# Altium project OnePhase.PrjPcb
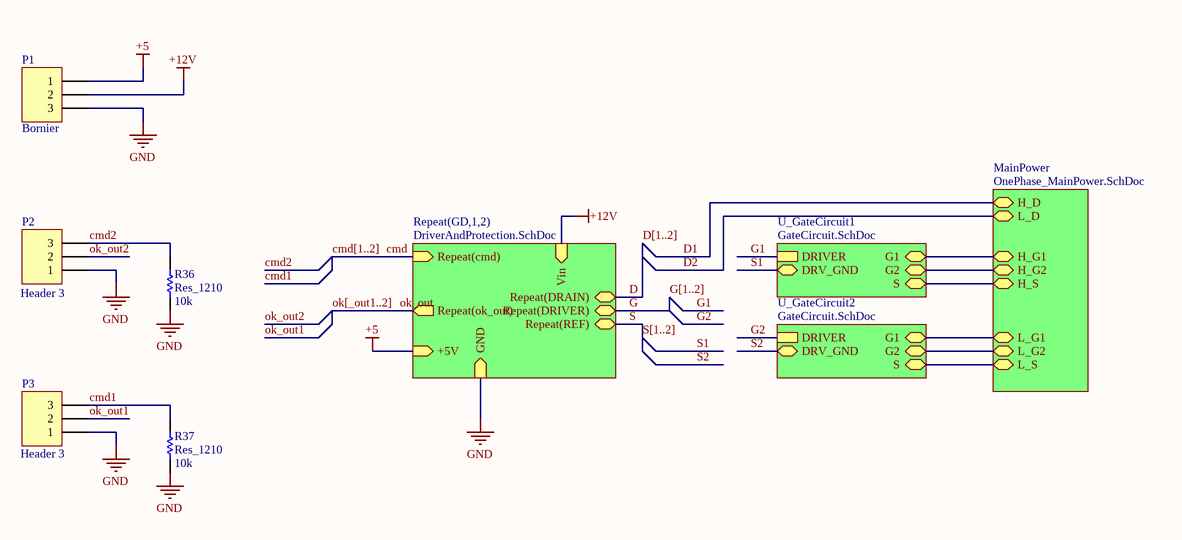
[diagram p0: OnePhaseMain.SchDoc]
5 sheets, 211 parts. Net scope: strictly hierarchical (ports join the sheet entries above them; power ports are local).
Board files: OnePhaseSemLogica_V4.PcbDoc, OnePhaseSemLogica_V3.PcbDoc, OnePhaseSemLogica_V1.PcbDoc
Sheets:
  OnePhaseMain.SchDoc
    GD1 = DriverAndProtection.SchDoc
      Supply_Iso = GateDriverPowerSupply.SchDoc
    GD2 = DriverAndProtection.SchDoc
      Supply_Iso = GateDriverPowerSupply.SchDoc
    MainPower = OnePhase_MainPower.SchDoc
    U_GateCircuit1 = GateCircuit.SchDoc
    U_GateCircuit2 = GateCircuit.SchDoc

## Sheet OnePhaseMain.SchDoc: Test of one arm
size A4; CheckedBy: Hildo Guillardi Júnior; Author: Fellipe; Organization: UNICAMP / LCEE; Address1: University of Campinas - Brazil; Address2: Power Conditioning Laboratory; Address3: Licensed by GNU GPL 3.0; PageSetup: Record=PageOptions|CenterHorizontal=True|CenterVertical=True|PrintScale=0.97|XCorrection=1.00|YCorrection=1.00|PrintKind=1|BorderSize=5000000|LeftOffset=0|BottomOffset=0|Orientation=2|PaperLength=1000|PaperWidth=1000|Scale=100|PaperSource=257|PrintQuality=600|MediaType=1|DitherType=10|PrintScaleMode=1|PaperKind=A4|PaperIndex=9; ProjectName: Easy Inverter

### Parts
P1  Bornier  [3 Pin  Borner]
P2  Header 3  [HDR1X3]
P3  Header 3  [HDR1X3]
R36  Res_1210  value 10k  [0805_W]
R37  Res_1210  value 10k  [0805_W]

### Sub-sheets
MainPower = OnePhase_MainPower.SchDoc: H_D, L_D, L_S, H_S, L_G1, H_G1, H_G2, L_G2
Repeat(GD,1,2) = DriverAndProtection.SchDoc: Repeat(cmd) (in), Repeat(DRAIN), Repeat(DRIVER), Repeat(REF), GND (in), Vin (in), +5V (in), Repeat(ok_out) (out)
U_GateCircuit1 = GateCircuit.SchDoc: DRIVER, S, G1, DRV_GND, G2
U_GateCircuit2 = GateCircuit.SchDoc: DRIVER, S, G1, DRV_GND, G2

### Nets
+5: P1.1 ; sheet Repeat(GD,1,2)/+5V
+12V: P1.2 ; sheet Repeat(GD,1,2)/Vin
GND: P1.3 P2.1 P3.1 R36.2 R37.2 ; sheet Repeat(GD,1,2)/GND
cmd: sheet Repeat(GD,1,2)/Repeat(cmd)
cmd1: P3.3 R37.1
cmd2: P2.3 R36.1
D: sheet Repeat(GD,1,2)/Repeat(DRAIN)
D2: sheet MainPower/L_D, sheet MainPower/H_S, sheet U_GateCircuit1/S
G: sheet Repeat(GD,1,2)/Repeat(DRIVER)
ok_out: sheet Repeat(GD,1,2)/Repeat(ok_out)
ok_out1: P3.2
ok_out2: P2.2
S: sheet Repeat(GD,1,2)/Repeat(REF)
NetC28_2: sheet MainPower/L_S, sheet U_GateCircuit2/S
NetQ5_1: sheet MainPower/H_G1, sheet U_GateCircuit1/G1
NetQ6_1: sheet MainPower/H_G2, sheet U_GateCircuit1/G2
NetQ7_1: sheet MainPower/L_G1, sheet U_GateCircuit2/G1
NetQ8_1: sheet MainPower/L_G2, sheet U_GateCircuit2/G2

### Buses and harness runs
bus cmd[1..2]
bus D[1..2]
bus G[1..2]
bus ok[_out1..2]
bus S[1..2]

### Notes on the sheet
- Title
- Author
- Revisor
- Hildo G Jr
- Revision:
- Sheet
- of
- File:
- Size:
- A4
- HGJr

### Library data of the parts
P1 = Header 3: Header, 3-Pin; pn: 1935174; Value: Bornier
P2 P3 = Header 3: Header, 3-Pin; Value: Header 3
R36 R37 = Res_0805: Resistor; pn: RMCF0805JT10K0

## Sheet DriverAndProtection.SchDoc: Drive and protections
size A4; CheckedBy: Hildo Guillardi Júnior; Author: Fellipe; Organization: UNICAMP / LCEE; Address1: University of Campinas - Brazil; Address2: Power Conditioning Laboratory; Address3: Licensed by GNU GPL 3.0; ProjectName: Easy Inverter
Used 2 times, as channels GD1, GD2. Parts and nets are listed once, with the designators drawn on the sheet.
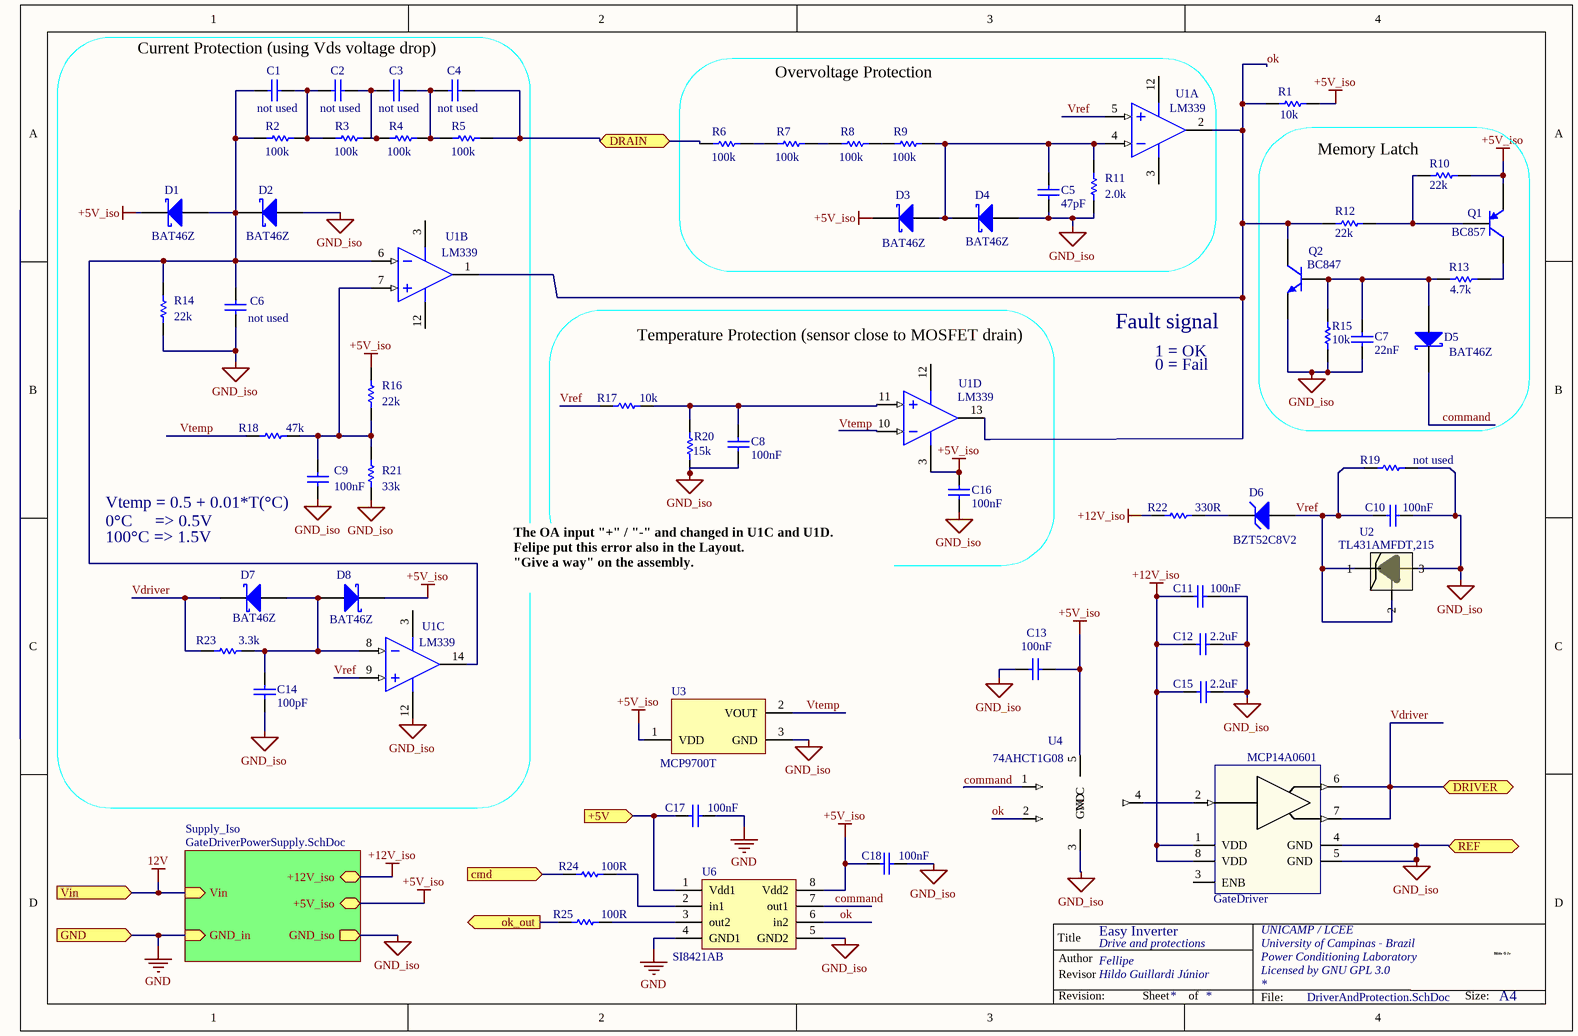
[diagram p1: DriverAndProtection.SchDoc]

### Parts
C1  value not used  [0805_W]
C2  value not used  [0805_W]
C3  value not used  [0805_W]
C4  value not used  [0805_W]
C5  value 47pF  [0805_W]
C6  value not used  [0805_W]
C7  value 22nF  [0805_W]
C8  value 100nF  [0805_W]
C9  value 100nF  [0805_W]
C10  value 100nF  [0805_W]
C11  value 100nF  [0805_W]
C12  value 2.2uF  [0805_W]
C13  value 100nF  [0805_W]
C14  value 100pF  [0805_W]
C15  value 2.2uF  [0805_W]
C16  value 100nF  [0805_W]
C17  value 100nF  [0805_W]
C18  value 100nF  [0805_W]
D1  value BAT46Z  [SOD-123]
D2  value BAT46Z  [SOD-123]
D3  value BAT46Z  [SOD-123]
D4  value BAT46Z  [SOD-123]
D5  value BAT46Z  [SOD-123]
D6  value BZT52C8V2  [SOD-123]
D7  value BAT46Z  [SOD-123]
D8  value BAT46Z  [SOD-123]
GateDriver  value MCP14A0601  [SOIC-8N]
Q1  value BC857  [SOT-23-TT3_N]
Q2  value BC847  [SOT-23-TT3_N]
R1  value 10k  [0805_W]
R2  value 100k  [0805_W]
R3  value 100k  [0805_W]
R4  value 100k  [0805_W]
R5  value 100k  [0805_W]
R6  value 100k  [0805_W]
R7  value 100k  [0805_W]
R8  value 100k  [0805_W]
R9  value 100k  [0805_W]
R10  value 22k  [0805_W]
R11  value 2.0k  [0805_W]
R12  value 22k  [0805_W]
R13  value 4.7k  [0805_W]
R14  value 22k  [0805_W]
R15  value 10k  [0805_W]
R16  value 22k  [0805_W]
R17  value 10k  [0805_W]
R18  value 47k  [0805_W]
R19  value not used  [0805_W]
R20  value 15k  [0805_W]
R21  value 33k  [0805_W]
R22  value 330R  [0805_W]
R23  value 3.3k  [0805_W]
R24  value 100R  [0805_W]
R25  value 100R  [0805_W]
U1  value LM339  [SOIC-14N]  (parts A,B,C,D of 4)
U2  value TL431AMFDT,215  [SOT-23-TT3_M]
U3  value MCP9700T  [SOT-23_L]
U4  value 74AHCT1G08  [SOT353]
U6  value SI8421AB  [SOIC-8N]

### Blocks framed on the sheet
Overvoltage Protection: C5 D3 D4 R6-R9 R11 U1
Memory Latch: C7 D5 Q1 Q2 R10 R12 R13 R15
Temperature Protection (sensor close to MOSFET drain): C8 C16 R17 R20 U1

### Sub-sheets
Supply_Iso = GateDriverPowerSupply.SchDoc: +12V_iso (bidir), +5V_iso (bidir), GND_iso (out), GND_in (in), Vin (in)

### Ports
+5V (in), cmd (in), DRAIN, DRIVER, GND (in), ok_out (out), REF, Vin (in)

### Nets
12V: port Vin, sheet Supply_Iso/Vin
+5V_iso: C13.1 C16.1 C18.2 D1.2(K) D3.2(K) D8.2(K) Q1.2(E) R1.2 R10.1 R16.2 U1.3(V+) U3.1(VDD) U4.5(VCC) U6.8(Vdd2) ; sheet Supply_Iso/+5V_iso
+12V_iso: C11.2 C12.1 C15.1 GateDriver.1(VDD) GateDriver.8(VDD) R22.1 ; sheet Supply_Iso/+12V_iso
GND: C17.1 U6.4(GND1) ; port GND, sheet Supply_Iso/GND_in
GND_iso: C5.2 C6.2 C7.2 C8.2 C9.2 C10.2 C11.1 C12.2 C13.2 C14.2 C15.2 C16.2 C18.1 D2.1(A) D4.1(A) GateDriver.4(GND) GateDriver.5(GND) Q2.2(E) R11.1 R14.1 R15.2 R19.2 R20.2 R21.2 U1.12(V-) U2.3 U3.3(GND) U4.3(GND) U6.5(GND2) ; port REF, sheet Supply_Iso/GND_iso
+5V: C17.2 U6.1(Vdd1) ; port +5V
cmd: R24.2 ; port cmd
command: D5.2(K) U4.1(OE*) U6.7(out1)
DRAIN: C4.1 R5.2 R6.2 ; port DRAIN
ok: Q2.3(C) R1.1 R12.2 U1.1(OUT) U1.2(OUT) U1.13(OUT) U4.2(IN) U6.6(in2)
ok_out: R25.2 ; port ok_out
Vdriver: D7.2(K) GateDriver.6 GateDriver.7 R23.2 ; port DRIVER
Vref: C10.1 D6.1(A) R17.2 R19.1 U1.5(IN+) U1.9(IN+) U2.1 U2.2
Vtemp: R18.2 U3.2(VOUT)
NetC1_1: C1.1 C2.2 R2.2 R3.2
NetC1_2: C1.2 C6.1 D1.1(A) D2.2(K) R2.1 R14.2 U1.6(IN-) U1.14(OUT)
NetC2_1: C2.1 C3.2 R3.1 R4.2
NetC3_1: C3.1 C4.2 R4.1 R5.1
NetC5_1: C5.1 D3.1(A) D4.2(K) R9.1 R11.2 U1.4(IN-)
NetC7_1: C7.1 D5.1(A) Q2.1(B) R13.2 R15.1
NetC8_1: C8.1 R17.1 R20.1 U1.11(IN+)
NetC9_1: C9.1 R16.1 R18.1 R21.1 U1.7(IN+)
NetC14_1: C14.1 D7.1(A) D8.1(A) R23.1 U1.8(IN-)
NetD6_2: D6.2(K) R22.2
NetGateDriver_2: GateDriver.2 U4.4(OUT)
NetQ1_1: Q1.1(B) R10.2 R12.1
NetQ1_3: Q1.3(C) R13.1
NetR6_1: R6.1 R7.2
NetR7_1: R7.1 R8.2
NetR8_1: R8.1 R9.2
NetR24_1: R24.1 U6.2(in1)
NetR25_1: R25.1 U6.3(out2)

Not connected (* = marked no-connect by the designer): GateDriver 3(ENB); U1 10(IN-)

### Channels
GD1: designators C1=C1.1 C2=C2.1 C3=C3.1 C4=C4.1 C5=C5.1 C6=C6.1 C7=C7.1 C8=C32.1 C9=C9.1 C10=C10.1 C11=C11.1 C12=C12.1 C13=C13.1 C14=C14.1 C15=C15.1 C16=C16.1 C17=C17.1 C18=C18.1 D1=D1.1 D2=D2.1 D3=D3.1 D4=D4.1 D5=D5.1 D6=D6.1 D7=D7.1 D8=D8.1 GateDriver=GateDriver.1 Q1=Q1.1 Q2=Q2.1 R1=R1.1 R2=R2.1 R3=R3.1 R4=R4.1 R5=R5.1 R6=R6.1 R7=R7.1 R8=R8.1 R9=R9.1 R10=R10.1 R11=R11.1 R12=R12.1 R13=R13.1 R14=R14.1 R15=R15.1 R16=R16.1 R17=R17.1 R18=R18.1 R19=R19.1 R20=R20.1 R21=R21.1 R22=R22.1 R23=R23.1 R24=R24.1 R25=R25.1 U1=U1.1 U2=U2.1 U3=U3.1 U4=U4.1 U6=U6.1; ports +5V=+5 cmd=cmd1 DRAIN=D1 DRIVER=G1 GND=GND ok_out=ok_out1 REF=S1 Vin=+12V
GD2: designators C1=C1.2 C2=C2.2 C3=C3.2 C4=C4.2 C5=C5.2 C6=C6.2 C7=C7.2 C8=C32.2 C9=C9.2 C10=C10.2 C11=C11.2 C12=C12.2 C13=C13.2 C14=C14.2 C15=C15.2 C16=C16.2 C17=C17.2 C18=C18.2 D1=D1.2 D2=D2.2 D3=D3.2 D4=D4.2 D5=D5.2 D6=D6.2 D7=D7.2 D8=D8.2 GateDriver=GateDriver.2 Q1=Q1.2 Q2=Q2.2 R1=R1.2 R2=R2.2 R3=R3.2 R4=R4.2 R5=R5.2 R6=R6.2 R7=R7.2 R8=R8.2 R9=R9.2 R10=R10.2 R11=R11.2 R12=R12.2 R13=R13.2 R14=R14.2 R15=R15.2 R16=R16.2 R17=R17.2 R18=R18.2 R19=R19.2 R20=R20.2 R21=R21.2 R22=R22.2 R23=R23.2 R24=R24.2 R25=R25.2 U1=U1.2 U2=U2.2 U3=U3.2 U4=U4.2 U6=U6.2; ports +5V=+5 cmd=cmd2 DRAIN=D2 DRIVER=G2 GND=GND ok_out=ok_out2 REF=S2 Vin=+12V

### Notes on the sheet
- Current Protection (using Vds voltage drop)
- (near Q2) Fault signal
- 1 = OK
- 0 = Fail
- (near C9) Vtemp = 0.5 + 0.01*T(°C)
- 0°C     => 0.5V
- 100°C => 1.5V
- The OA input "+" / "-" and changed in U1C and U1D.
  Felipe put this error also in the Layout.
  "Give a way" on the assembly.
- Labels drawn without touching a wire or pin: Vtemp
- Title
- Author
- Revisor
- Hildo G Jr
- Revision:
- Sheet
- of
- File:
- Size:
- A4
- HGJr

### Library data of the parts
C1-C4 C6 = Cap_0805: Capacitor
  C1-C4: Published: 8-Jun-2000; LatestRevisionDate: 17-Jul-2002; LatestRevisionNote: Re-released for DXP Platform.; PackageReference: RAD-0.3; Publisher: Altium Limited
C5 = Cap_0805: Capacitor; pn: C0805C473K8RAC7800
C7 = Cap_0805: Capacitor; pn: C0805C223K8RACTU
C8-C11 C17 C18 = Cap_0805: Capacitor; pn: 08053C104KAT2A
C12 C15 = Capacitor_nao_polarizado: Capacitor nao polarizado; pn: 08053C225KAT2A
C13 C16 = Cap_0805: Capacitor; pn: C0805C104K8RACTU
C14 = Cap_0805: Capacitor; pn: 08053C101KAT2A
D1-D4 D7 D8 = D Schottky: Schottky Diode; pn: BAT46ZFILM
D5 = Schottky: Diodo Schottky; pn: BAT46ZFILM
D6 = D Zener: Zener Diode; pn: BZT52C8V2-FDICT-ND
GateDriver = GateDriver: pn: MIC4420YM-TR;MIC4422ZM
Q1 = BC857: PNP General-purpose Transistor; pn: BC857BLT1G
Q2 = BC847: NPN General-purpose Transistor; pn: BC847BLT1G
R1 R17 = Res_0805: Resistor; pn: RMCF0805JT10K0
R2-R9 = Res_0805: Resistor; pn: RMCF0805JT100K
R10 = Res_0805: Resistor- Not Used; pn: RMCF0805JT22K0
R11 = Res_0805: Resistor; pn: RMCF0805JT2K00
R12 R16 = Res_0805: Resistor; pn: RMCF0805JT22K0
R13 = Res_0805: Resistor; pn: RMCF0805JT4K70
R14 = Res_0805: Resistor; pn: RMCF0805JT560K
R15 = Res_0805: Resistor- Not Used; pn: RMCF0805JT10K0
R18 = Res_0805: Resistor; pn: RMCF0805JT5K60
R19 = Res_0805: Resistor- Not Used
R20 = Res_0805: Resistor; pn: RMCF0805JT15K0
R21 = Res_0805: Resistor; pn: RMCF0805JT33K0
R22 = Res_0805: Resistor- Not Used; pn: RMCF0805JT330R
R23 = Res_0805: Resistor; pn: RMCF0805JT3k30
R24 R25 = Res_0805: Resistor; pn: RMCF0805JT100R
U1 = LM339AD: Low-Power Quad Voltage Comparator; pn: LM339DT
U2 = TL431ACLP: pn: TL431AMFDT\,215
U3 = MCP9700T-E/TT: Low-Power Linear Active Thermistor IC, 3-Pin SOT-23, Extended Temperature, Tape and Reel; pn: MCP9700T-E/TT
U4 = AND: pn: 74AHCT1G08SE-7
U6 = Si8421: Two Channel, High Speed Digital Isolators; pn: SI8421AB-D-IS;SI8422BB-D-IS;FOD8012A

## Sheet GateDriverPowerSupply.SchDoc: Isolated power supply
size A4; Date: Power Conditioning Laboratory; CheckedBy: Hildo / Joel; Author: Fellipe / Arthur; Organization: UNICAMP / LCEE; Address1: University of Campinas - Brazil; Address2: Power Conditioning Laboratory; Address3: Licensed by GNU GPL 3.0; CurrentTime: University of Campinas - Brazil; DocumentFullPathAndName: Licensed by GNU GPL 3.0; ProjectName: Easy Inverter
Used 2 times, as channels GD1/Supply_Iso, GD2/Supply_Iso. Parts and nets are listed once, with the designators drawn on the sheet.
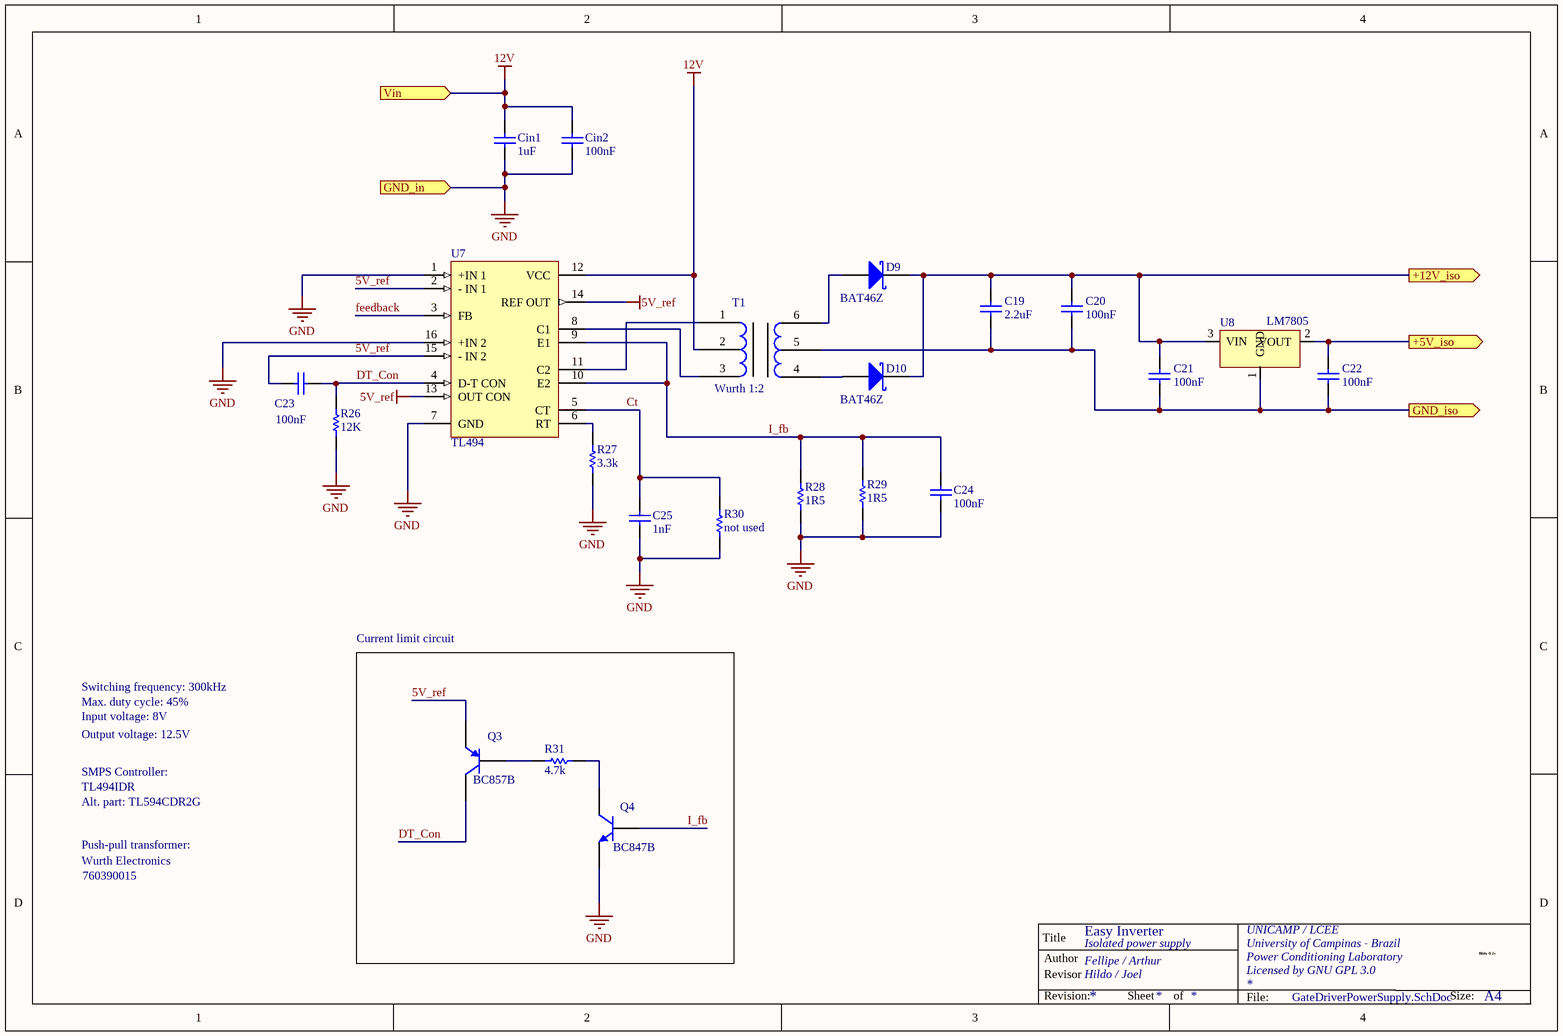
[diagram p2: GateDriverPowerSupply.SchDoc]

### Parts
C19  value 2.2uF  [0805_W]
C20  value 100nF  [0805_W]
C21  value 100nF  [0805_W]
C22  value 100nF  [0805_W]
C23  value 100nF  [0805_W]
C24  value 100nF  [0805_W]
C25  value 1nF  [0805_W]
Cin1  value 1uF  [0805_W]
Cin2  value 100nF  [0805_W]
D9  value BAT46Z  [SOD-123]
D10  value BAT46Z  [SOD-123]
Q3  value BC857B  [SOT-23-TT3_N]
Q4  value BC847B  [SOT-23-TT3_N]
R26  value 12K  [0805_W]
R27  value 3.3k  [0805_W]
R28  value 1R5  [0805_W]
R29  value 1R5  [0805_W]
R30  value not used  [0805_W]
R31  value 4.7k  [0805_W]
T1  value Wurth 1:2  [Trafo]
U7  value TL494  [SOIC16_M]
U8  value LM7805  [LM78XX]

### Blocks framed on the sheet
Current limit circuit: Q3 Q4 R31

### Ports
+5V_iso (out), +12V_iso (out), GND_in (in), GND_iso (out), Vin (in)

### Nets
5V_ref: C23.1 Q3.2(E) U7.2(-_IN_1) U7.13(OUT_CON) U7.14(REF_OUT) U7.15(-_IN_2)
12V: Cin1.1 Cin2.1 T1.2 U7.12(VCC) ; port Vin
GND: C24.1 C25.2 Cin1.2 Cin2.2 Q4.2(E) R26.1 R27.1 R28.1 R29.1 R30.1 U7.1(+IN_1) U7.7(GND) U7.16(+IN_2) ; port GND_in
+5V_iso: C22.1 U8.2(VOUT) ; port +5V_iso
+12V_iso: C19.1 C20.1 C21.1 D9.2(K) D10.2(K) U8.3(VIN) ; port +12V_iso
Ct: C25.1 R30.2 U7.5(CT)
DT_Con: C23.2 Q3.3(C) R26.2 U7.4(D-T_CON)
feedback: U7.3(FB)
GND_iso: C19.2 C20.2 C21.2 C22.2 T1.5 U8.1(GND) ; port GND_iso
I_fb: C24.2 Q4.1(B) R28.2 R29.2 U7.9(E1) U7.10(E2)
NetD9_1: D9.1(A) T1.6
NetD10_1: D10.1(A) T1.4
NetQ3_1: Q3.1(B) R31.2
NetQ4_3: Q4.3(C) R31.1
NetR27_2: R27.2 U7.6(RT)
NetT1_1: T1.1 U7.11(C2)
NetT1_3: T1.3 U7.8(C1)

### Channels
GD1/Supply_Iso: designators end in .1; ports +5V_iso=+5V_iso +12V_iso=+12V_iso GND_in=GND GND_iso=S1 Vin=+12V
GD2/Supply_Iso: designators end in .2; ports +5V_iso=+5V_iso +12V_iso=+12V_iso GND_in=GND GND_iso=S2 Vin=+12V

### Notes on the sheet
- Switching frequency: 300kHz
- Max. duty cycle: 45%
- Input voltage: 8V
- SMPS Controller:
- TL494IDR
- Output voltage: 12.5V
- Alt. part: TL594CDR2G
- Push-pull transformer:
- Wurth Electronics
- 760390015
- Title
- Author
- Revisor
- Hildo G Jr
- Revision:
- Sheet
- of
- File:
- Size:
- A4
- HGJr

### Library data of the parts
C19 = Capacitor_nao_polarizado: as C12 on sheet DriverAndProtection
C20-C22 = Capacitor_nao_polarizado: Capacitor nao polarizado; pn: 08053C104KAT2A
C23 C24 Cin2 = Cap_0805: Capacitor; pn: 08053C104KAT2A
C25 = Cap_0805: Capacitor; pn: 08053C102KAT2A
Cin1 = Cap_0805: Capacitor; pn: 08053C105KAT2A
D9 D10 = D Schottky: Schottky Diode; pn: BAT46ZFILM
Q3 = BC857: as Q1 on sheet DriverAndProtection
Q4 = BC847: as Q2 on sheet DriverAndProtection
R26 = Res_0805: Resistor; pn: RMCF0805JT12K0
R27 = Res_0805: Resistor; pn: RMCF0805JT3K30
R28 R29 = Res_0805: Resistor; pn: RMCF0805JT1R50
R30 = Res_0805: Resistor; Manufacturer: Generic Components; Class: Passive; Published: 08/06/2000; Publisher: Altium Hobart Technology Centre; SubClass: Resistor
R31 = Res_0805: Resistor; pn: RMCF0805JT4K70
T1 = Trafo-TI: pn: 760390015
U7 = TL494ID: Pulse-Width-Modulation Control Circuit; pn: TL494IDR
U8 = LM7805: pn: UA78M05CDCY

## Sheet OnePhase_MainPower.SchDoc: One phase test
size A4; CheckedBy: Arthur; Author: Hildo Guillardi Júnior; Organization: UNICAMP / LCEE; Address1: University of Campinas - Brazil; Address2: Power Conditioning Laboratory; Address3: Licensed by GNU GPL 3.0; ProjectName: Easy Inverter
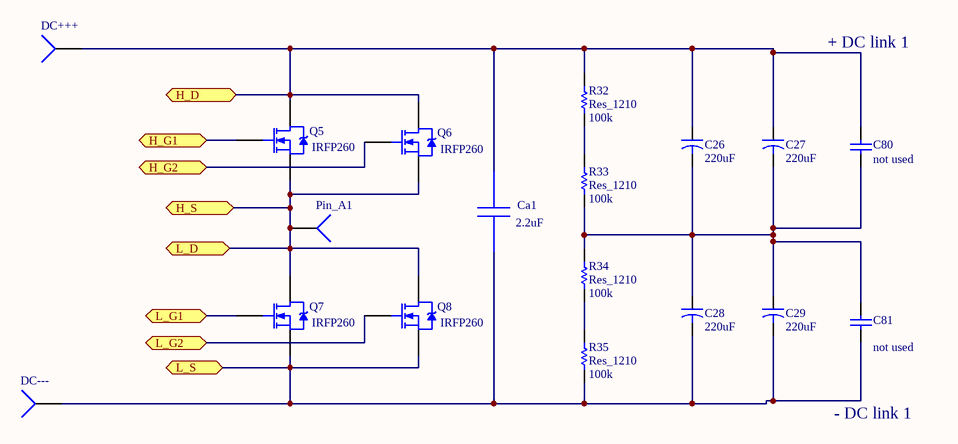
[diagram p3: OnePhase_MainPower.SchDoc]

### Parts
C26  value 220uF  [Capacitor Eletrolitico - duplicate]  (hidden comment: Cap2)
C27  value 220uF  [Capacitor Eletrolitico - duplicate]  (hidden comment: Cap2)
C28  value 220uF  [Capacitor Eletrolitico - duplicate]  (hidden comment: Cap2)
C29  value 220uF  [Capacitor Eletrolitico - duplicate]  (hidden comment: Cap2)
C80  value not used  [Capacitor_Pol_15x6mm]
C81  value not used  [Capacitor_Pol_15x6mm]
Ca1  value 2.2uF  [Capacitor_Pol_2Sizes]
DC+++  Socket  [Power conector]  (value not drawn)
DC---  Socket  [Power conector]  (value not drawn)
Pin_A1  Socket  [Power conector]  (value not drawn)
Q5  IRFP260  [TO227]
Q6  IRFP260  [TO227]
Q7  IRFP260  [TO227]
Q8  IRFP260  [TO227]
R32  Res_1210  value 100k  [1210_W]
R33  Res_1210  value 100k  [1210_W]
R34  Res_1210  value 100k  [1210_W]
R35  Res_1210  value 100k  [1210_W]

### Ports
H_D, H_G1, H_G2, H_S, L_D, L_G1, L_G2, L_S

### Nets
D1: C26.1 C27.1 C80.2 Ca1.1 DC+++.1 Q5.2(D) Q6.2(D) R32.1 ; port H_D
D2: Pin_A1.1 Q5.3(S) Q6.3(S) Q7.2(D) Q8.2(D) ; port L_D, port H_S
NetC26_2: C26.2 C27.2 C28.1 C29.1 C80.1 C81.2 R33.2 R34.1
NetC28_2: C28.2 C29.2 C81.1 Ca1.2 DC---.1 Q7.3(S) Q8.3(S) R35.2 ; port L_S
NetQ5_1: Q5.1(G) ; port H_G1
NetQ6_1: Q6.1(G) ; port H_G2
NetQ7_1: Q7.1(G) ; port L_G1
NetQ8_1: Q8.1(G) ; port L_G2
NetR32_2: R32.2 R33.1
NetR34_2: R34.2 R35.1

### Notes on the sheet
- + DC link 1
- - DC link 1
- Title
- Author
- Revisor
- Hildo G Jr
- Revision:
- Sheet
- of
- File:
- Size:
- A4
- HGJr

### Library data of the parts
C26-C29 = Cap2: Capacitor; pn: B43305B9227M000
C80 C81 = Cap: Capacitor
Ca1 = GRM21BC81E475KA12L: GRM21BC81E475KA1; pn: R463R422000M1M
DC+++ DC--- = Socket: pn: 7799; Value: screw
Pin_A1 = Socket: pn: 7799
Q5-Q8 = IRFP260: HEXFET Power MOSFET; pn: 4180G; RM3X10MM 2701; IRFP260MPBF; 28N65M2; C3M0280090D; Value: IRFP260
R32-R35 = Res_0805: Resistor; pn: RMCF1210JT100K

## Sheet GateCircuit.SchDoc: Gate drive circuit
size A4; Author: Hildo Guillardi Júnior; Organization: UNICAMP / LCEE; Address1: University of Campinas - Brazil; Address2: Power Conditioning Laboratory; Address3: Licensed by GNU GPL 3.0; ProjectName: Easy Inverter
Used 2 times, as channels U_GateCircuit1, U_GateCircuit2. Parts and nets are listed once, with the designators drawn on the sheet.
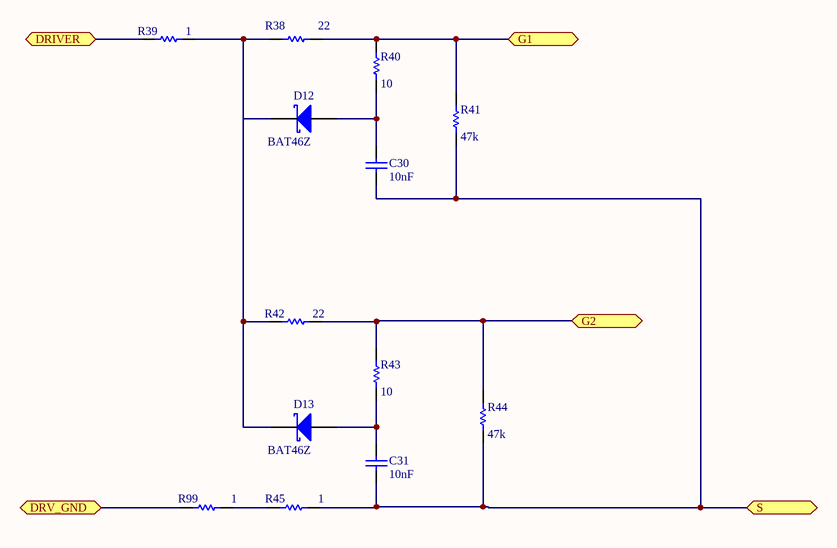
[diagram p4: GateCircuit.SchDoc]

### Parts
C30  value 10nF  [0805_W]
C31  value 10nF  [0805_W]
D12  value BAT46Z  [SOD-123]
D13  value BAT46Z  [SOD-123]
R38  value 22  [1210_W]
R39  value 1  [0805_W]
R40  value 10  [0805_W]
R41  value 47k  [0805_W]
R42  value 22  [1210_W]
R43  value 10  [0805_W]
R44  value 47k  [0805_W]
R45  value 1  [0805_W]
R99  value 1  [0805_W]

### Ports
DRIVER, DRV_GND, G1, G2, S

### Nets
DRIVER: R39.2 ; port DRIVER
DRV_GND: R99.2 ; port DRV_GND
G1: R38.1 R40.1 R41.1 ; port G1
G2: R42.1 R43.1 R44.1 ; port G2
S: C30.1 C31.1 R41.2 R44.2 R45.1 ; port S
NetC30_2: C30.2 D12.1(A) R40.2
NetC31_2: C31.2 D13.1(A) R43.2
NetD12_2: D12.2(K) D13.2(K) R38.2 R39.1 R42.2
NetR45_2: R45.2 R99.1

### Channels
U_GateCircuit1: designators end in .1; ports DRIVER=G1 DRV_GND=S1 G1=NetQ5_1 G2=NetQ6_1 S=D2
U_GateCircuit2: designators end in .2; ports DRIVER=G2 DRV_GND=S2 G1=NetQ7_1 G2=NetQ8_1 S=NetC28_2

### Notes on the sheet
- Title
- Author
- Revisor
- Hildo G Jr
- Revision:
- Sheet
- of
- File:
- Size:
- A4
- HGJr

### Library data of the parts
C30 C31 = Cap_0805: Capacitor; Published: 8-Jun-2000; LatestRevisionDate: 17-Jul-2002; LatestRevisionNote: Re-released for DXP Platform.; PackageReference: RAD-0.3; Publisher: Altium Limited
D12 D13 = Schottky: Diodo Schottky; pn: BAT46ZFILM
R38-R45 R99 = Res_0805: as R30 on sheet GateDriverPowerSupply; Published: 08/06/2000; Publisher: Altium Hobart Technology Centre; SubClass: Resistor

## Nets that join several sheets
+5: OnePhaseMain (P1.1), GD1 (C17.1.2 U6.1.1), GD2 (C17.2.2 U6.2.1)
+5V_iso: GD1 (14 pins), GD1/Supply_Iso (C22.1.1 U8.1.2)
+5V_iso: GD2 (14 pins), GD2/Supply_Iso (C22.2.1 U8.2.2)
+12V: OnePhaseMain (P1.2), GD1/Supply_Iso (Cin1.1.1 Cin2.1.1 T1.1.2 U7.1.12), GD2/Supply_Iso (Cin1.2.1 Cin2.2.1 T1.2.2 U7.2.12)
+12V_iso: GD1 (6 pins), GD1/Supply_Iso (6 pins)
+12V_iso: GD2 (6 pins), GD2/Supply_Iso (6 pins)
GND: OnePhaseMain (5 pins), GD1 (C17.1.1 U6.1.4), GD1/Supply_Iso (13 pins), GD2 (C17.2.1 U6.2.4), GD2/Supply_Iso (13 pins)
S1: GD1 (29 pins), GD1/Supply_Iso (6 pins), U_GateCircuit1 (R99.1.2)
S2: GD2 (29 pins), GD2/Supply_Iso (6 pins), U_GateCircuit2 (R99.2.2)
cmd1: OnePhaseMain (P3.3 R37.1), GD1 (R24.1.2)
cmd2: OnePhaseMain (P2.3 R36.1), GD2 (R24.2.2)
D1: GD1 (C4.1.1 R5.1.2 R6.1.2), OnePhase_MainPower (8 pins)
D2: GD2 (C4.2.1 R5.2.2 R6.2.2), OnePhase_MainPower (5 pins), U_GateCircuit1 (5 pins)
G1: GD1 (D7.1.2 GateDriver.1.6 GateDriver.1.7 R23.1.2), U_GateCircuit1 (R39.1.2)
G2: GD2 (D7.2.2 GateDriver.2.6 GateDriver.2.7 R23.2.2), U_GateCircuit2 (R39.2.2)
NetC28_2: OnePhase_MainPower (8 pins), U_GateCircuit2 (5 pins)
NetQ5_1: OnePhase_MainPower (Q5.1), U_GateCircuit1 (R38.1.1 R40.1.1 R41.1.1)
NetQ6_1: OnePhase_MainPower (Q6.1), U_GateCircuit1 (R42.1.1 R43.1.1 R44.1.1)
NetQ7_1: OnePhase_MainPower (Q7.1), U_GateCircuit2 (R38.2.1 R40.2.1 R41.2.1)
NetQ8_1: OnePhase_MainPower (Q8.1), U_GateCircuit2 (R42.2.1 R43.2.1 R44.2.1)
ok_out1: OnePhaseMain (P3.2), GD1 (R25.1.2)
ok_out2: OnePhaseMain (P2.2), GD2 (R25.2.2)